# EAGLE board ETEST01 (EAGLE 7.3.0), part 1 of 2
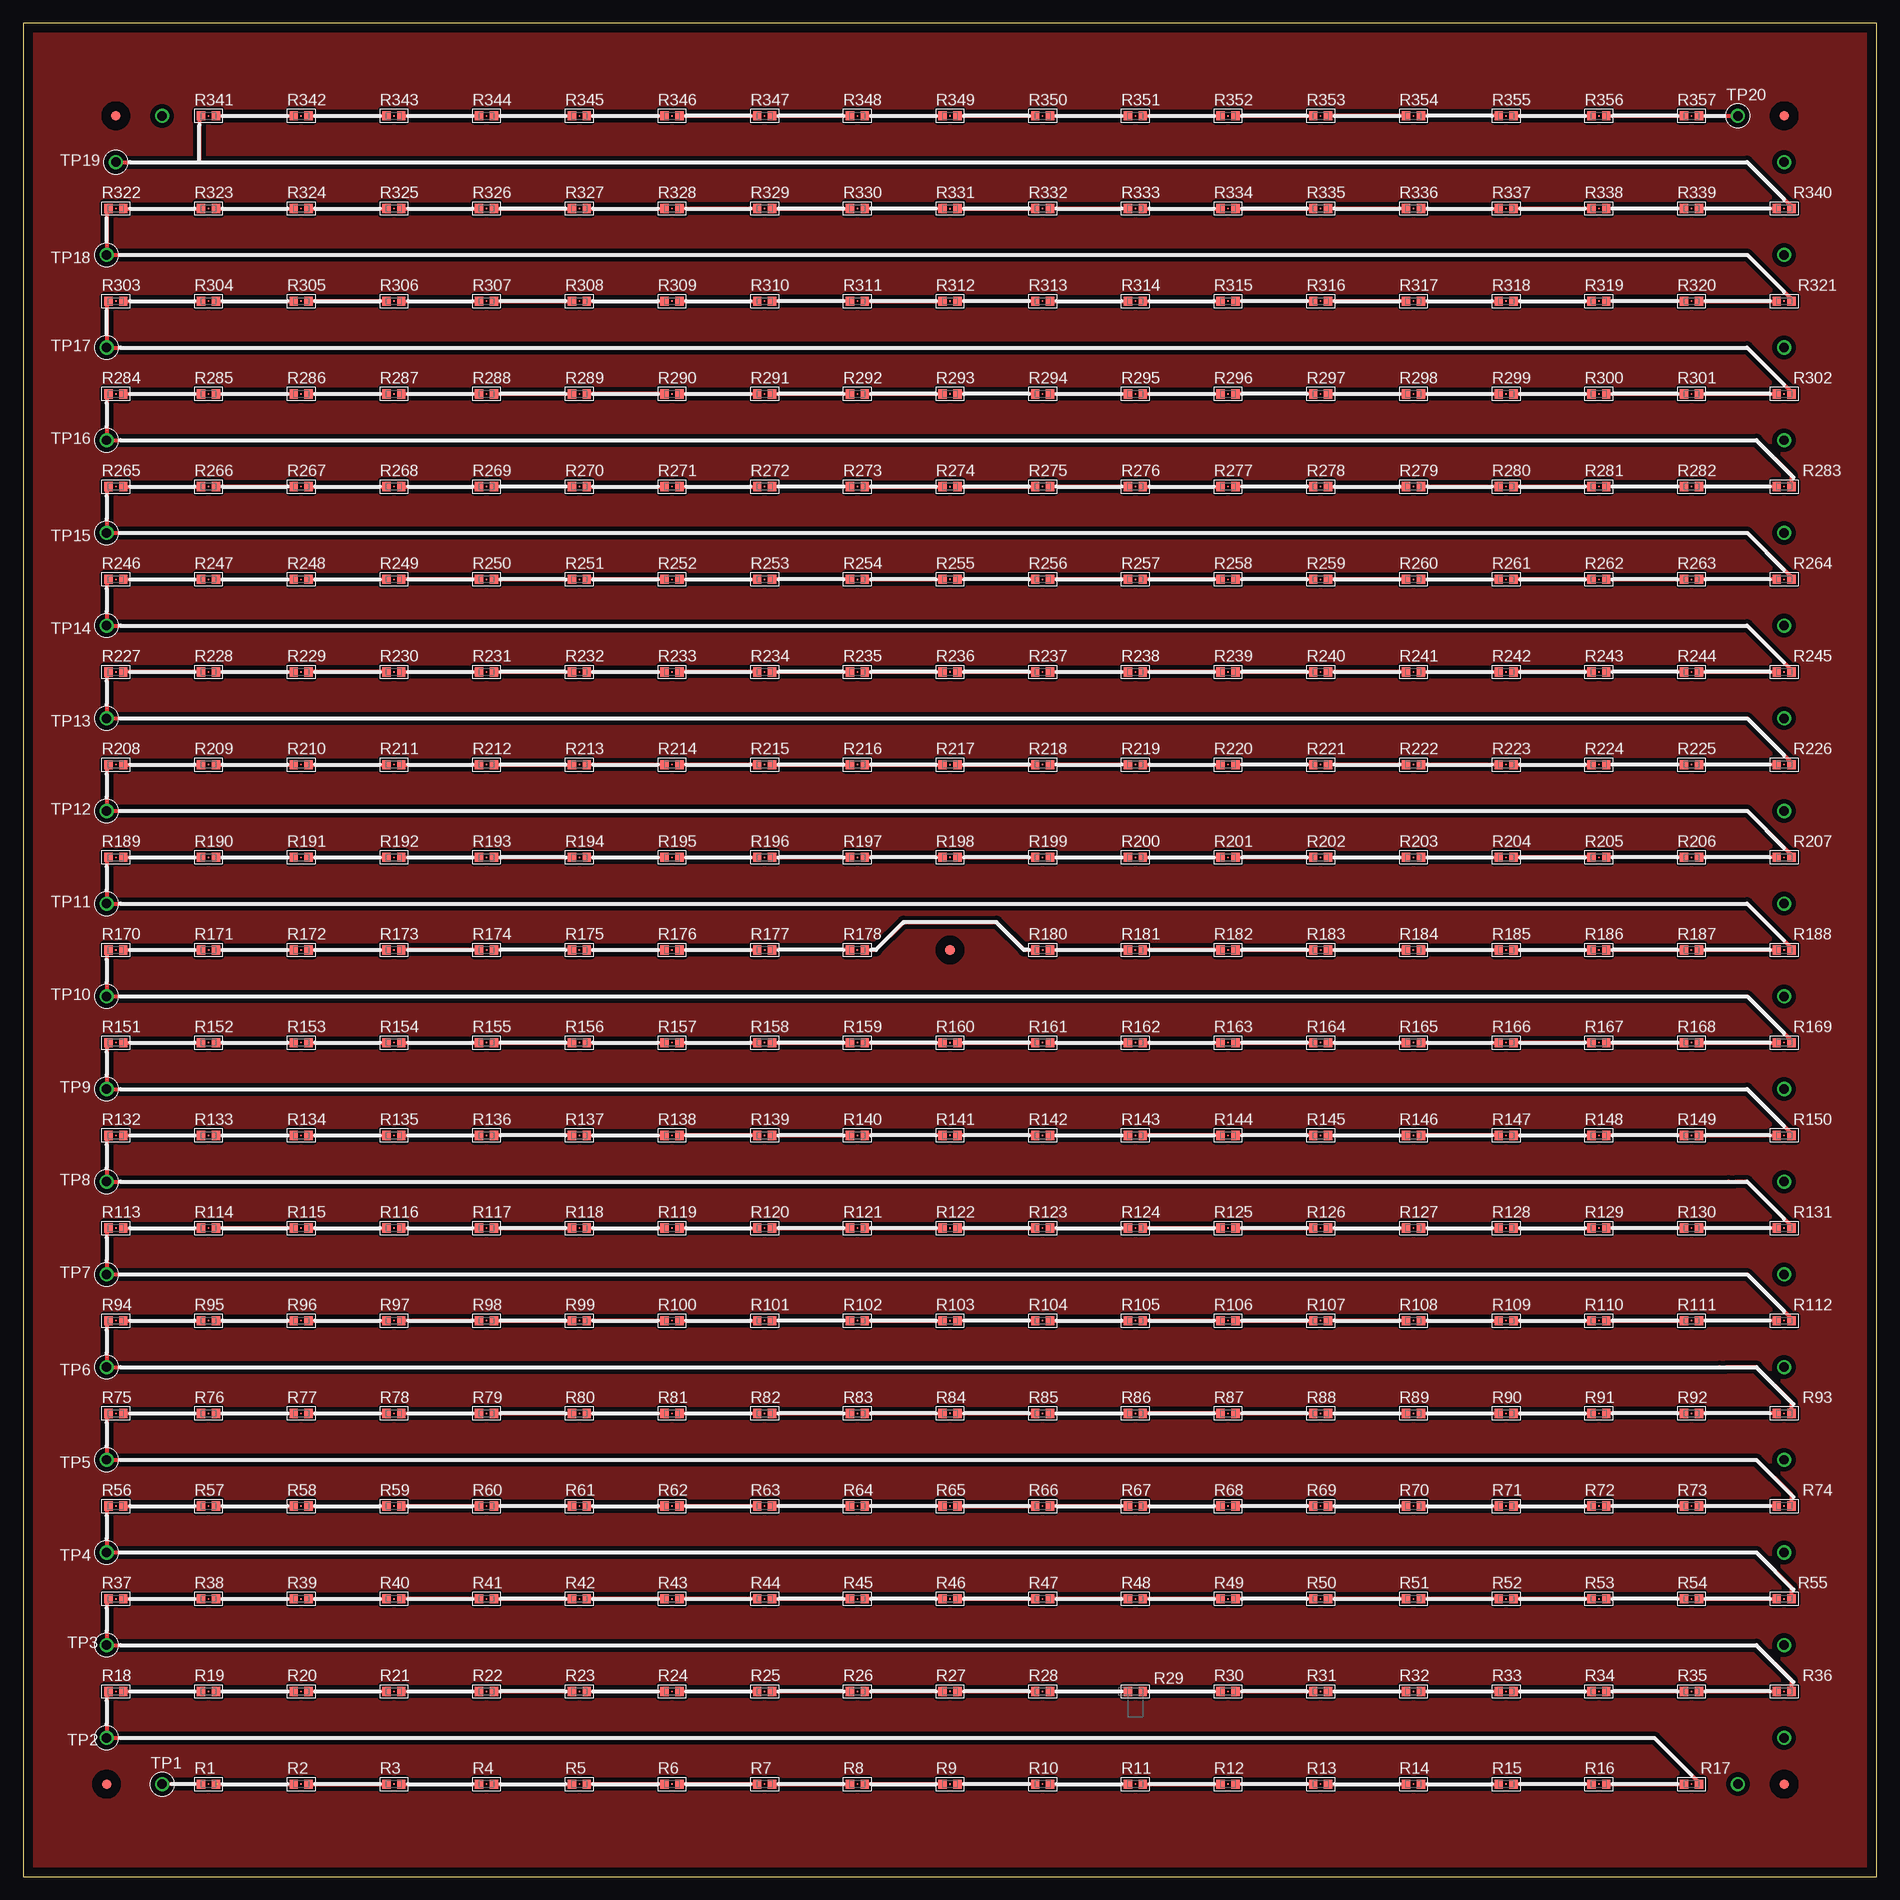
[diagram p2: board, top side]
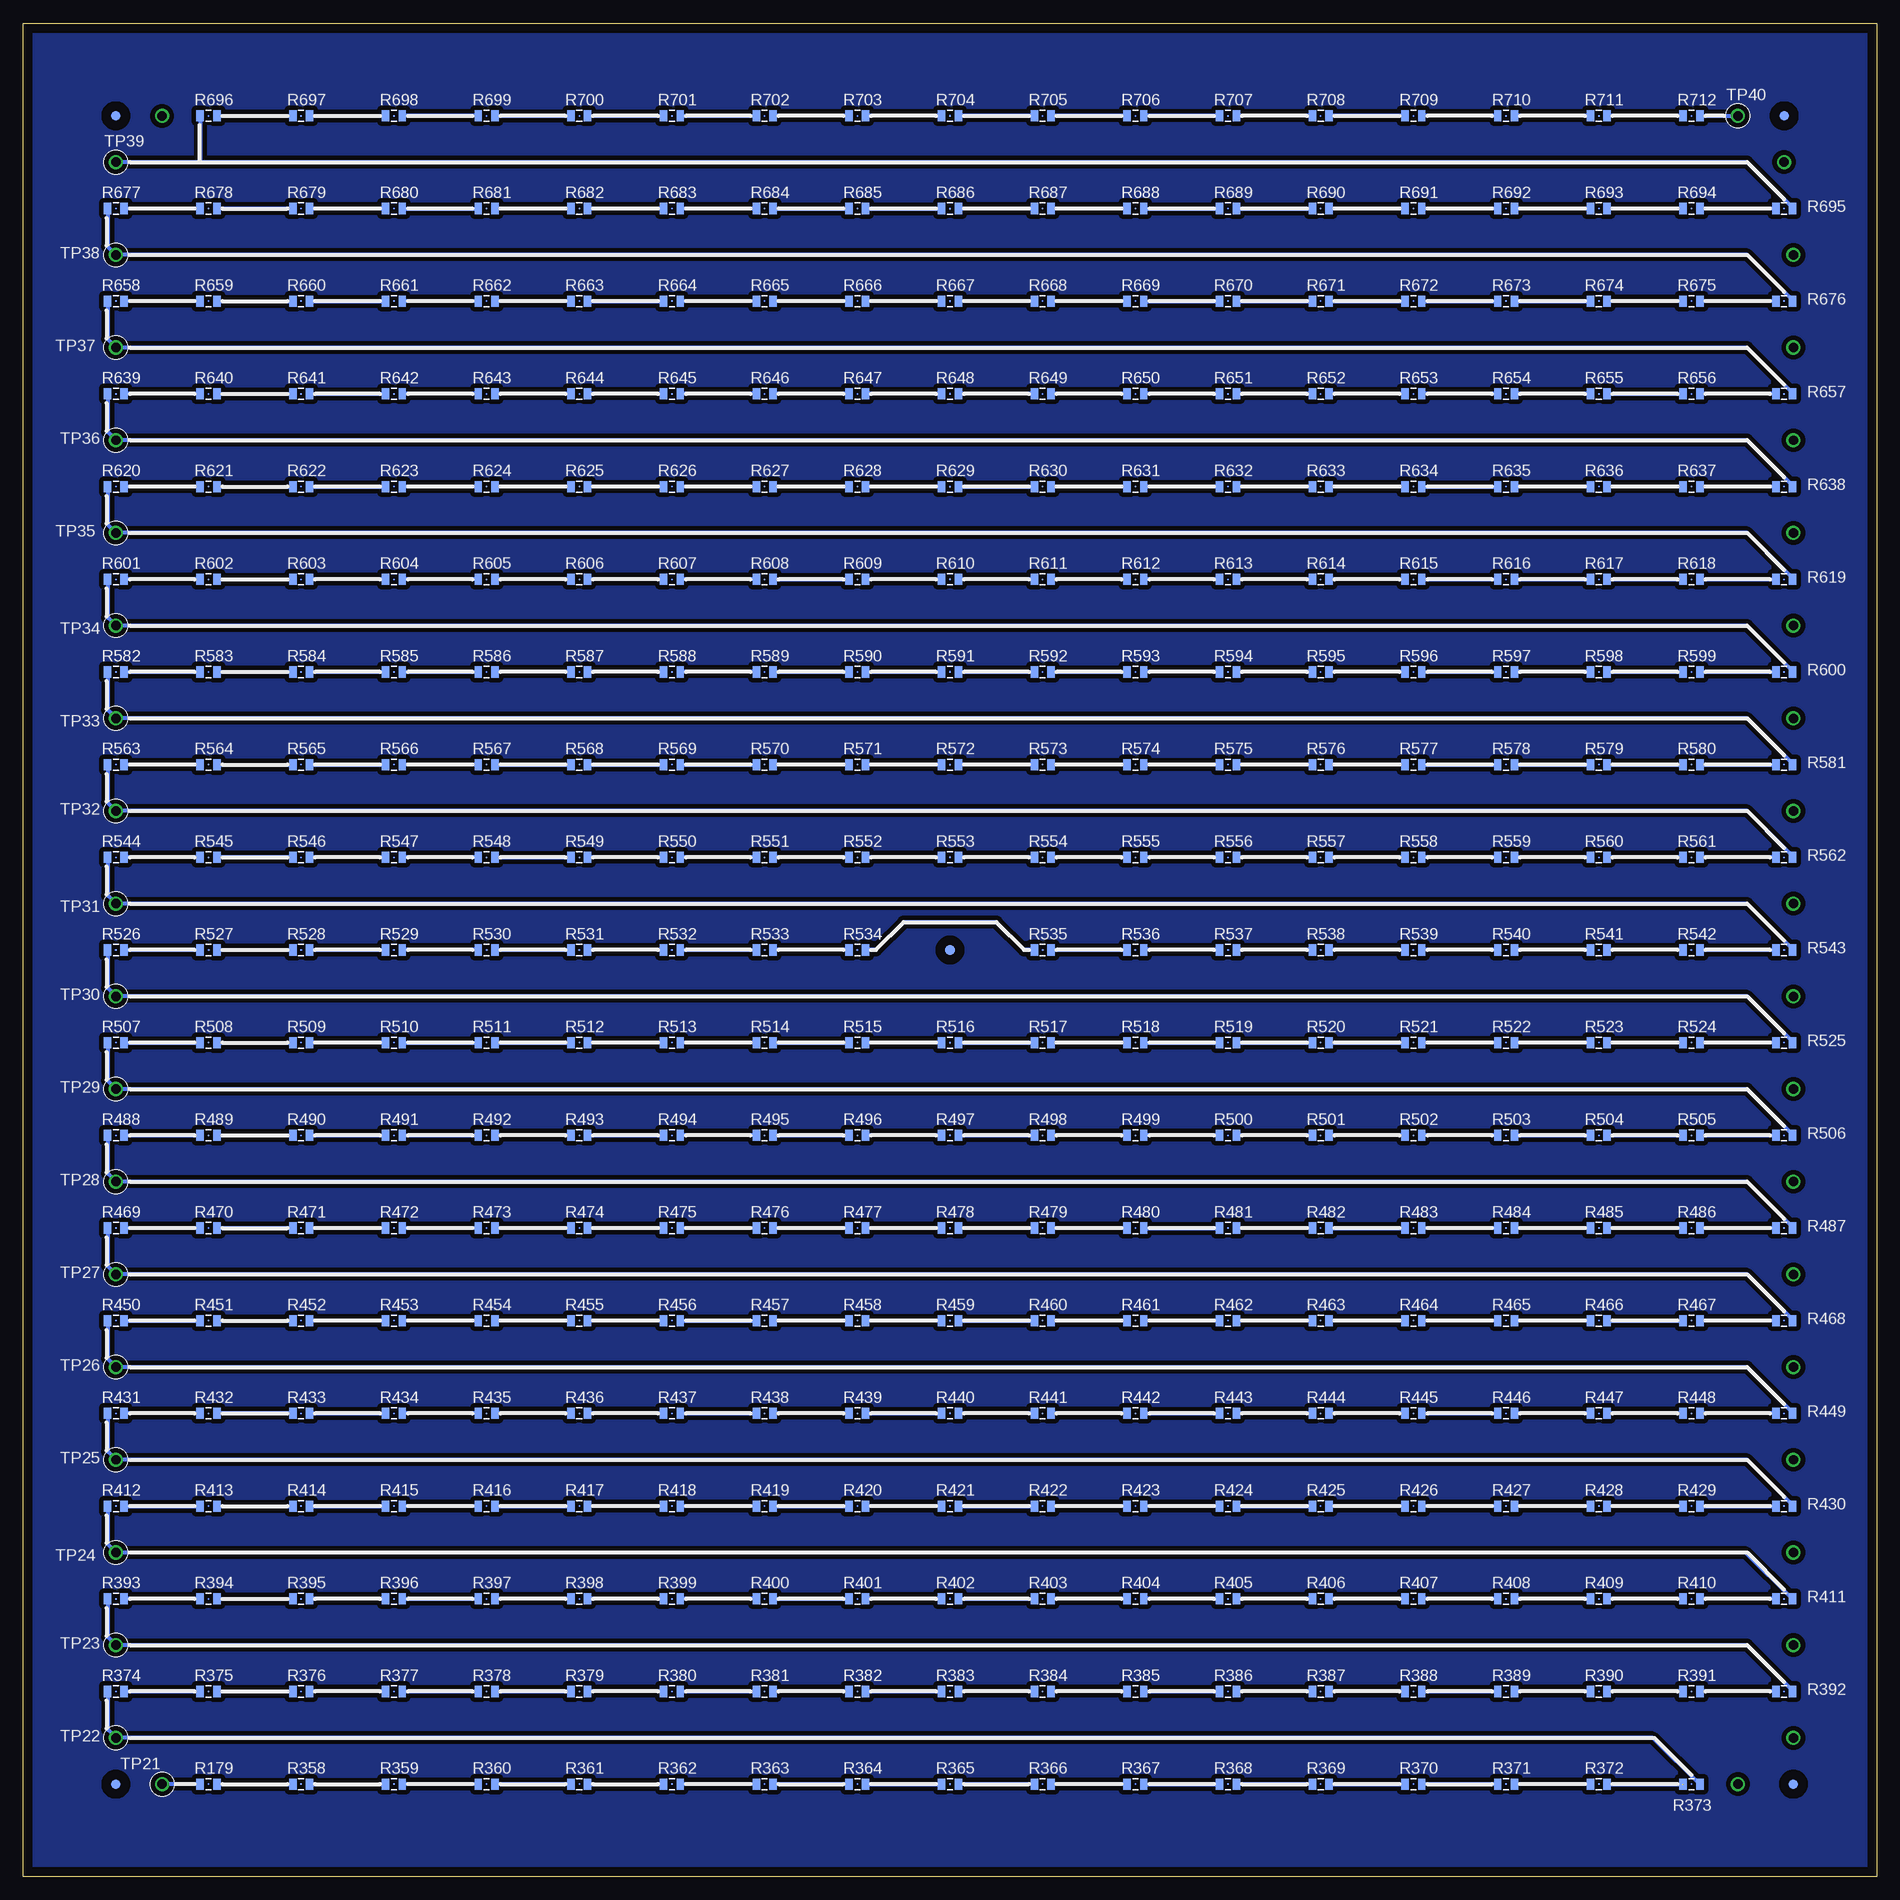
[diagram p3: board, bottom side, seen from below]

Size 200 x 200 mm. Coordinates in mm from the lower left corner, seen from the top.
Outline: 0,0 200,0 200,200 0,200 0,0
Copper layers (1*16): Top 0.035mm / dielectric 1.5mm / Bottom 0.035mm
Design rules "default": minimum track width 10mil, minimum drill 24mil, track to track 8mil, track to pad 8mil, pad to pad 8mil, via to via 8mil, smd to smd 8mil, copper to edge 40mil, drill to drill 8mil, minimum pad ring 10mil, minimum via ring 8mil, stop-mask expansion 4mil, vias tented up to drill 0mil, thermal gap 10mil

## Footprints (pad centres in the part's own frame; a part is rotated, then mirrored left to right if it is on the bottom)
FIDUCIAL = smd 1 x 1: 1 0,0
TESTPKG-R0603 = smd 0.9 x 1: 1 -0.8,0; 2 0.8,0 | smd 0.2 x 0.2: VISION-DOT 0,0
R0603 = smd 0.9 x 1: 1 -0.8,0; 2 0.8,0
TESTPKG-R0805 = smd 0.8 x 1.2: 1 -0.9,0; 2 0.9,0 | smd 0.2 x 0.2: VISION-DOT 0,0
CON-TESTPOINT = drill 1.016: 1 0,0

## Placement (x,y rotation side)
FID1  FIDUCIAL  [FIDUCIAL]  9,10 0 top
FID2  FIDUCIAL  [FIDUCIAL]  190,10 0 top
FID3  FIDUCIAL  [FIDUCIAL]  190,190 0 top
FID4  FIDUCIAL  [FIDUCIAL]  10,190 0 top
FID5  FIDUCIAL  [FIDUCIAL]  100,100 0 top
FID6  FIDUCIAL  [FIDUCIAL]  190,10 0 bottom
FID7  FIDUCIAL  [FIDUCIAL]  9,10 0 bottom
FID8  FIDUCIAL  [FIDUCIAL]  10,190 0 bottom
FID9  FIDUCIAL  [FIDUCIAL]  190,190 0 bottom
FID10  FIDUCIAL  [FIDUCIAL]  100,100 0 bottom
R1  TESTPKG-RESISTOR0603  [TESTPKG-R0603]  20,10 0 top
R2  TESTPKG-RESISTOR0603  [TESTPKG-R0603]  30,10 0 top
R3  TESTPKG-RESISTOR0603  [TESTPKG-R0603]  40,10 0 top
R4  TESTPKG-RESISTOR0603  [TESTPKG-R0603]  50,10 0 top
R5  TESTPKG-RESISTOR0603  [TESTPKG-R0603]  60,10 0 top
R6  TESTPKG-RESISTOR0603  [TESTPKG-R0603]  70,10 0 top
R7  TESTPKG-RESISTOR0603  [TESTPKG-R0603]  80,10 0 top
R8  TESTPKG-RESISTOR0603  [TESTPKG-R0603]  90,10 0 top
R9  TESTPKG-RESISTOR0603  [TESTPKG-R0603]  100,10 0 top
R10  TESTPKG-RESISTOR0603  [TESTPKG-R0603]  110,10 0 top
R11  TESTPKG-RESISTOR0603  [TESTPKG-R0603]  120,10 0 top
R12  TESTPKG-RESISTOR0603  [TESTPKG-R0603]  130,10 0 top
R13  TESTPKG-RESISTOR0603  [TESTPKG-R0603]  140,10 0 top
R14  TESTPKG-RESISTOR0603  [TESTPKG-R0603]  150,10 0 top
R15  TESTPKG-RESISTOR0603  [TESTPKG-R0603]  160,10 0 top
R16  TESTPKG-RESISTOR0603  [TESTPKG-R0603]  170,10 0 top
R17  TESTPKG-RESISTOR0603  [TESTPKG-R0603]  180,10 0 top
R18  TESTPKG-RESISTOR0603  [TESTPKG-R0603]  10,20 0 top
R19  TESTPKG-RESISTOR0603  [TESTPKG-R0603]  20,20 0 top
R20  TESTPKG-RESISTOR0603  [TESTPKG-R0603]  30,20 0 top
R21  TESTPKG-RESISTOR0603  [TESTPKG-R0603]  40,20 0 top
R22  TESTPKG-RESISTOR0603  [TESTPKG-R0603]  50,20 0 top
R23  TESTPKG-RESISTOR0603  [TESTPKG-R0603]  60,20 0 top
R24  TESTPKG-RESISTOR0603  [TESTPKG-R0603]  70,20 0 top
R25  TESTPKG-RESISTOR0603  [TESTPKG-R0603]  80,20 0 top
R26  TESTPKG-RESISTOR0603  [TESTPKG-R0603]  90,20 0 top
R27  TESTPKG-RESISTOR0603  [TESTPKG-R0603]  100,20 0 top
R28  TESTPKG-RESISTOR0603  [TESTPKG-R0603]  110,20 0 top
R29  CPL-RES-0603-0-0.1W  [R0603]  120,20 0 top
R30  TESTPKG-RESISTOR0603  [TESTPKG-R0603]  130,20 0 top
R31  TESTPKG-RESISTOR0603  [TESTPKG-R0603]  140,20 0 top
R32  TESTPKG-RESISTOR0603  [TESTPKG-R0603]  150,20 0 top
R33  TESTPKG-RESISTOR0603  [TESTPKG-R0603]  160,20 0 top
R34  TESTPKG-RESISTOR0603  [TESTPKG-R0603]  170,20 0 top
R35  TESTPKG-RESISTOR0603  [TESTPKG-R0603]  180,20 0 top
R36  TESTPKG-RESISTOR0603  [TESTPKG-R0603]  190,20 0 top
R37  TESTPKG-RESISTOR0603  [TESTPKG-R0603]  10,30 0 top
R38  TESTPKG-RESISTOR0603  [TESTPKG-R0603]  20,30 0 top
R39  TESTPKG-RESISTOR0603  [TESTPKG-R0603]  30,30 0 top
R40  TESTPKG-RESISTOR0603  [TESTPKG-R0603]  40,30 0 top
R41  TESTPKG-RESISTOR0603  [TESTPKG-R0603]  50,30 0 top
R42  TESTPKG-RESISTOR0603  [TESTPKG-R0603]  60,30 0 top
R43  TESTPKG-RESISTOR0603  [TESTPKG-R0603]  70,30 0 top
R44  TESTPKG-RESISTOR0603  [TESTPKG-R0603]  80,30 0 top
R45  TESTPKG-RESISTOR0603  [TESTPKG-R0603]  90,30 0 top
R46  TESTPKG-RESISTOR0603  [TESTPKG-R0603]  100,30 0 top
R47  TESTPKG-RESISTOR0603  [TESTPKG-R0603]  110,30 0 top
R48  TESTPKG-RESISTOR0603  [TESTPKG-R0603]  120,30 0 top
R49  TESTPKG-RESISTOR0603  [TESTPKG-R0603]  130,30 0 top
R50  TESTPKG-RESISTOR0603  [TESTPKG-R0603]  140,30 0 top
R51  TESTPKG-RESISTOR0603  [TESTPKG-R0603]  150,30 0 top
R52  TESTPKG-RESISTOR0603  [TESTPKG-R0603]  160,30 0 top
R53  TESTPKG-RESISTOR0603  [TESTPKG-R0603]  170,30 0 top
R54  TESTPKG-RESISTOR0603  [TESTPKG-R0603]  180,30 0 top
R55  TESTPKG-RESISTOR0603  [TESTPKG-R0603]  190,30 0 top
R56  TESTPKG-RESISTOR0603  [TESTPKG-R0603]  10,40 0 top
R57  TESTPKG-RESISTOR0603  [TESTPKG-R0603]  20,40 0 top
R58  TESTPKG-RESISTOR0603  [TESTPKG-R0603]  30,40 0 top
R59  TESTPKG-RESISTOR0603  [TESTPKG-R0603]  40,40 0 top
R60  TESTPKG-RESISTOR0603  [TESTPKG-R0603]  50,40 0 top
R61  TESTPKG-RESISTOR0603  [TESTPKG-R0603]  60,40 0 top
R62  TESTPKG-RESISTOR0603  [TESTPKG-R0603]  70,40 0 top
R63  TESTPKG-RESISTOR0603  [TESTPKG-R0603]  80,40 0 top
R64  TESTPKG-RESISTOR0603  [TESTPKG-R0603]  90,40 0 top
R65  TESTPKG-RESISTOR0603  [TESTPKG-R0603]  100,40 0 top
R66  TESTPKG-RESISTOR0603  [TESTPKG-R0603]  110,40 0 top
R67  TESTPKG-RESISTOR0603  [TESTPKG-R0603]  120,40 0 top
R68  TESTPKG-RESISTOR0603  [TESTPKG-R0603]  130,40 0 top
R69  TESTPKG-RESISTOR0603  [TESTPKG-R0603]  140,40 0 top
R70  TESTPKG-RESISTOR0603  [TESTPKG-R0603]  150,40 0 top
R71  TESTPKG-RESISTOR0603  [TESTPKG-R0603]  160,40 0 top
R72  TESTPKG-RESISTOR0603  [TESTPKG-R0603]  170,40 0 top
R73  TESTPKG-RESISTOR0603  [TESTPKG-R0603]  180,40 0 top
R74  TESTPKG-RESISTOR0603  [TESTPKG-R0603]  190,40 0 top
R75  TESTPKG-RESISTOR0603  [TESTPKG-R0603]  10,50 0 top
R76  TESTPKG-RESISTOR0603  [TESTPKG-R0603]  20,50 0 top
R77  TESTPKG-RESISTOR0603  [TESTPKG-R0603]  30,50 0 top
R78  TESTPKG-RESISTOR0603  [TESTPKG-R0603]  40,50 0 top
R79  TESTPKG-RESISTOR0603  [TESTPKG-R0603]  50,50 0 top
R80  TESTPKG-RESISTOR0603  [TESTPKG-R0603]  60,50 0 top
R81  TESTPKG-RESISTOR0603  [TESTPKG-R0603]  70,50 0 top
R82  TESTPKG-RESISTOR0603  [TESTPKG-R0603]  80,50 0 top
R83  TESTPKG-RESISTOR0603  [TESTPKG-R0603]  90,50 0 top
R84  TESTPKG-RESISTOR0603  [TESTPKG-R0603]  100,50 0 top
R85  TESTPKG-RESISTOR0603  [TESTPKG-R0603]  110,50 0 top
R86  TESTPKG-RESISTOR0603  [TESTPKG-R0603]  120,50 0 top
R87  TESTPKG-RESISTOR0603  [TESTPKG-R0603]  130,50 0 top
R88  TESTPKG-RESISTOR0603  [TESTPKG-R0603]  140,50 0 top
R89  TESTPKG-RESISTOR0603  [TESTPKG-R0603]  150,50 0 top
R90  TESTPKG-RESISTOR0603  [TESTPKG-R0603]  160,50 0 top
R91  TESTPKG-RESISTOR0603  [TESTPKG-R0603]  170,50 0 top
R92  TESTPKG-RESISTOR0603  [TESTPKG-R0603]  180,50 0 top
R93  TESTPKG-RESISTOR0603  [TESTPKG-R0603]  190,50 0 top
R94  TESTPKG-RESISTOR0603  [TESTPKG-R0603]  10,60 0 top
R95  TESTPKG-RESISTOR0603  [TESTPKG-R0603]  20,60 0 top
R96  TESTPKG-RESISTOR0603  [TESTPKG-R0603]  30,60 0 top
R97  TESTPKG-RESISTOR0603  [TESTPKG-R0603]  40,60 0 top
R98  TESTPKG-RESISTOR0603  [TESTPKG-R0603]  50,60 0 top
R99  TESTPKG-RESISTOR0603  [TESTPKG-R0603]  60,60 0 top
R100  TESTPKG-RESISTOR0603  [TESTPKG-R0603]  70,60 0 top
R101  TESTPKG-RESISTOR0603  [TESTPKG-R0603]  80,60 0 top
R102  TESTPKG-RESISTOR0603  [TESTPKG-R0603]  90,60 0 top
R103  TESTPKG-RESISTOR0603  [TESTPKG-R0603]  100,60 0 top
R104  TESTPKG-RESISTOR0603  [TESTPKG-R0603]  110,60 0 top
R105  TESTPKG-RESISTOR0603  [TESTPKG-R0603]  120,60 0 top
R106  TESTPKG-RESISTOR0603  [TESTPKG-R0603]  130,60 0 top
R107  TESTPKG-RESISTOR0603  [TESTPKG-R0603]  140,60 0 top
R108  TESTPKG-RESISTOR0603  [TESTPKG-R0603]  150,60 0 top
R109  TESTPKG-RESISTOR0603  [TESTPKG-R0603]  160,60 0 top
R110  TESTPKG-RESISTOR0603  [TESTPKG-R0603]  170,60 0 top
R111  TESTPKG-RESISTOR0603  [TESTPKG-R0603]  180,60 0 top
R112  TESTPKG-RESISTOR0603  [TESTPKG-R0603]  190,60 0 top
R113  TESTPKG-RESISTOR0603  [TESTPKG-R0603]  10,70 0 top
R114  TESTPKG-RESISTOR0603  [TESTPKG-R0603]  20,70 0 top
R115  TESTPKG-RESISTOR0603  [TESTPKG-R0603]  30,70 0 top
R116  TESTPKG-RESISTOR0603  [TESTPKG-R0603]  40,70 0 top
R117  TESTPKG-RESISTOR0603  [TESTPKG-R0603]  50,70 0 top
R118  TESTPKG-RESISTOR0603  [TESTPKG-R0603]  60,70 0 top
R119  TESTPKG-RESISTOR0603  [TESTPKG-R0603]  70,70 0 top
R120  TESTPKG-RESISTOR0603  [TESTPKG-R0603]  80,70 0 top
R121  TESTPKG-RESISTOR0603  [TESTPKG-R0603]  90,70 0 top
R122  TESTPKG-RESISTOR0603  [TESTPKG-R0603]  100,70 0 top
R123  TESTPKG-RESISTOR0603  [TESTPKG-R0603]  110,70 0 top
R124  TESTPKG-RESISTOR0603  [TESTPKG-R0603]  120,70 0 top
R125  TESTPKG-RESISTOR0603  [TESTPKG-R0603]  130,70 0 top
R126  TESTPKG-RESISTOR0603  [TESTPKG-R0603]  140,70 0 top
R127  TESTPKG-RESISTOR0603  [TESTPKG-R0603]  150,70 0 top
R128  TESTPKG-RESISTOR0603  [TESTPKG-R0603]  160,70 0 top
R129  TESTPKG-RESISTOR0603  [TESTPKG-R0603]  170,70 0 top
R130  TESTPKG-RESISTOR0603  [TESTPKG-R0603]  180,70 0 top
R131  TESTPKG-RESISTOR0603  [TESTPKG-R0603]  190,70 0 top
R132  TESTPKG-RESISTOR0603  [TESTPKG-R0603]  10,80 0 top
R133  TESTPKG-RESISTOR0603  [TESTPKG-R0603]  20,80 0 top
R134  TESTPKG-RESISTOR0603  [TESTPKG-R0603]  30,80 0 top
R135  TESTPKG-RESISTOR0603  [TESTPKG-R0603]  40,80 0 top
R136  TESTPKG-RESISTOR0603  [TESTPKG-R0603]  50,80 0 top
R137  TESTPKG-RESISTOR0603  [TESTPKG-R0603]  60,80 0 top
R138  TESTPKG-RESISTOR0603  [TESTPKG-R0603]  70,80 0 top
R139  TESTPKG-RESISTOR0603  [TESTPKG-R0603]  80,80 0 top
R140  TESTPKG-RESISTOR0603  [TESTPKG-R0603]  90,80 0 top
R141  TESTPKG-RESISTOR0603  [TESTPKG-R0603]  100,80 0 top
R142  TESTPKG-RESISTOR0603  [TESTPKG-R0603]  110,80 0 top
R143  TESTPKG-RESISTOR0603  [TESTPKG-R0603]  120,80 0 top
R144  TESTPKG-RESISTOR0603  [TESTPKG-R0603]  130,80 0 top
R145  TESTPKG-RESISTOR0603  [TESTPKG-R0603]  140,80 0 top
R146  TESTPKG-RESISTOR0603  [TESTPKG-R0603]  150,80 0 top
R147  TESTPKG-RESISTOR0603  [TESTPKG-R0603]  160,80 0 top
R148  TESTPKG-RESISTOR0603  [TESTPKG-R0603]  170,80 0 top
R149  TESTPKG-RESISTOR0603  [TESTPKG-R0603]  180,80 0 top
R150  TESTPKG-RESISTOR0603  [TESTPKG-R0603]  190,80 0 top
R151  TESTPKG-RESISTOR0603  [TESTPKG-R0603]  10,90 0 top
R152  TESTPKG-RESISTOR0603  [TESTPKG-R0603]  20,90 0 top
R153  TESTPKG-RESISTOR0603  [TESTPKG-R0603]  30,90 0 top
R154  TESTPKG-RESISTOR0603  [TESTPKG-R0603]  40,90 0 top
R155  TESTPKG-RESISTOR0603  [TESTPKG-R0603]  50,90 0 top
R156  TESTPKG-RESISTOR0603  [TESTPKG-R0603]  60,90 0 top
R157  TESTPKG-RESISTOR0603  [TESTPKG-R0603]  70,90 0 top
R158  TESTPKG-RESISTOR0603  [TESTPKG-R0603]  80,90 0 top
R159  TESTPKG-RESISTOR0603  [TESTPKG-R0603]  90,90 0 top
R160  TESTPKG-RESISTOR0603  [TESTPKG-R0603]  100,90 0 top
R161  TESTPKG-RESISTOR0603  [TESTPKG-R0603]  110,90 0 top
R162  TESTPKG-RESISTOR0603  [TESTPKG-R0603]  120,90 0 top
R163  TESTPKG-RESISTOR0603  [TESTPKG-R0603]  130,90 0 top
R164  TESTPKG-RESISTOR0603  [TESTPKG-R0603]  140,90 0 top
R165  TESTPKG-RESISTOR0603  [TESTPKG-R0603]  150,90 0 top
R166  TESTPKG-RESISTOR0603  [TESTPKG-R0603]  160,90 0 top
R167  TESTPKG-RESISTOR0603  [TESTPKG-R0603]  170,90 0 top
R168  TESTPKG-RESISTOR0603  [TESTPKG-R0603]  180,90 0 top
R169  TESTPKG-RESISTOR0603  [TESTPKG-R0603]  190,90 0 top
R170  TESTPKG-RESISTOR0603  [TESTPKG-R0603]  10,100 0 top
R171  TESTPKG-RESISTOR0603  [TESTPKG-R0603]  20,100 0 top
R172  TESTPKG-RESISTOR0603  [TESTPKG-R0603]  30,100 0 top
R173  TESTPKG-RESISTOR0603  [TESTPKG-R0603]  40,100 0 top
R174  TESTPKG-RESISTOR0603  [TESTPKG-R0603]  50,100 0 top
R175  TESTPKG-RESISTOR0603  [TESTPKG-R0603]  60,100 0 top
R176  TESTPKG-RESISTOR0603  [TESTPKG-R0603]  70,100 0 top
R177  TESTPKG-RESISTOR0603  [TESTPKG-R0603]  80,100 0 top
R178  TESTPKG-RESISTOR0603  [TESTPKG-R0603]  90,100 0 top
R179  TESTPKG-RESISTOR0805  [TESTPKG-R0805]  180,10 0 bottom
R180  TESTPKG-RESISTOR0603  [TESTPKG-R0603]  110,100 0 top
R181  TESTPKG-RESISTOR0603  [TESTPKG-R0603]  120,100 0 top
R182  TESTPKG-RESISTOR0603  [TESTPKG-R0603]  130,100 0 top
R183  TESTPKG-RESISTOR0603  [TESTPKG-R0603]  140,100 0 top
R184  TESTPKG-RESISTOR0603  [TESTPKG-R0603]  150,100 0 top
R185  TESTPKG-RESISTOR0603  [TESTPKG-R0603]  160,100 0 top
R186  TESTPKG-RESISTOR0603  [TESTPKG-R0603]  170,100 0 top
R187  TESTPKG-RESISTOR0603  [TESTPKG-R0603]  180,100 0 top
R188  TESTPKG-RESISTOR0603  [TESTPKG-R0603]  190,100 0 top
R189  TESTPKG-RESISTOR0603  [TESTPKG-R0603]  10,110 0 top
R190  TESTPKG-RESISTOR0603  [TESTPKG-R0603]  20,110 0 top
R191  TESTPKG-RESISTOR0603  [TESTPKG-R0603]  30,110 0 top
R192  TESTPKG-RESISTOR0603  [TESTPKG-R0603]  40,110 0 top
R193  TESTPKG-RESISTOR0603  [TESTPKG-R0603]  50,110 0 top
R194  TESTPKG-RESISTOR0603  [TESTPKG-R0603]  60,110 0 top
R195  TESTPKG-RESISTOR0603  [TESTPKG-R0603]  70,110 0 top
R196  TESTPKG-RESISTOR0603  [TESTPKG-R0603]  80,110 0 top
R197  TESTPKG-RESISTOR0603  [TESTPKG-R0603]  90,110 0 top
R198  TESTPKG-RESISTOR0603  [TESTPKG-R0603]  100,110 0 top
R199  TESTPKG-RESISTOR0603  [TESTPKG-R0603]  110,110 0 top
R200  TESTPKG-RESISTOR0603  [TESTPKG-R0603]  120,110 0 top
R201  TESTPKG-RESISTOR0603  [TESTPKG-R0603]  130,110 0 top
R202  TESTPKG-RESISTOR0603  [TESTPKG-R0603]  140,110 0 top
R203  TESTPKG-RESISTOR0603  [TESTPKG-R0603]  150,110 0 top
R204  TESTPKG-RESISTOR0603  [TESTPKG-R0603]  160,110 0 top
R205  TESTPKG-RESISTOR0603  [TESTPKG-R0603]  170,110 0 top
R206  TESTPKG-RESISTOR0603  [TESTPKG-R0603]  180,110 0 top
R207  TESTPKG-RESISTOR0603  [TESTPKG-R0603]  190,110 0 top
R208  TESTPKG-RESISTOR0603  [TESTPKG-R0603]  10,120 0 top
R209  TESTPKG-RESISTOR0603  [TESTPKG-R0603]  20,120 0 top
R210  TESTPKG-RESISTOR0603  [TESTPKG-R0603]  30,120 0 top
R211  TESTPKG-RESISTOR0603  [TESTPKG-R0603]  40,120 0 top
R212  TESTPKG-RESISTOR0603  [TESTPKG-R0603]  50,120 0 top
R213  TESTPKG-RESISTOR0603  [TESTPKG-R0603]  60,120 0 top
R214  TESTPKG-RESISTOR0603  [TESTPKG-R0603]  70,120 0 top
R215  TESTPKG-RESISTOR0603  [TESTPKG-R0603]  80,120 0 top
R216  TESTPKG-RESISTOR0603  [TESTPKG-R0603]  90,120 0 top
R217  TESTPKG-RESISTOR0603  [TESTPKG-R0603]  100,120 0 top
R218  TESTPKG-RESISTOR0603  [TESTPKG-R0603]  110,120 0 top
R219  TESTPKG-RESISTOR0603  [TESTPKG-R0603]  120,120 0 top
R220  TESTPKG-RESISTOR0603  [TESTPKG-R0603]  130,120 0 top
R221  TESTPKG-RESISTOR0603  [TESTPKG-R0603]  140,120 0 top
R222  TESTPKG-RESISTOR0603  [TESTPKG-R0603]  150,120 0 top
R223  TESTPKG-RESISTOR0603  [TESTPKG-R0603]  160,120 0 top
R224  TESTPKG-RESISTOR0603  [TESTPKG-R0603]  170,120 0 top
R225  TESTPKG-RESISTOR0603  [TESTPKG-R0603]  180,120 0 top
R226  TESTPKG-RESISTOR0603  [TESTPKG-R0603]  190,120 0 top
R227  TESTPKG-RESISTOR0603  [TESTPKG-R0603]  10,130 0 top
R228  TESTPKG-RESISTOR0603  [TESTPKG-R0603]  20,130 0 top
R229  TESTPKG-RESISTOR0603  [TESTPKG-R0603]  30,130 0 top
R230  TESTPKG-RESISTOR0603  [TESTPKG-R0603]  40,130 0 top
R231  TESTPKG-RESISTOR0603  [TESTPKG-R0603]  50,130 0 top
R232  TESTPKG-RESISTOR0603  [TESTPKG-R0603]  60,130 0 top
R233  TESTPKG-RESISTOR0603  [TESTPKG-R0603]  70,130 0 top
R234  TESTPKG-RESISTOR0603  [TESTPKG-R0603]  80,130 0 top
R235  TESTPKG-RESISTOR0603  [TESTPKG-R0603]  90,130 0 top
R236  TESTPKG-RESISTOR0603  [TESTPKG-R0603]  100,130 0 top
R237  TESTPKG-RESISTOR0603  [TESTPKG-R0603]  110,130 0 top
R238  TESTPKG-RESISTOR0603  [TESTPKG-R0603]  120,130 0 top
R239  TESTPKG-RESISTOR0603  [TESTPKG-R0603]  130,130 0 top
R240  TESTPKG-RESISTOR0603  [TESTPKG-R0603]  140,130 0 top
R241  TESTPKG-RESISTOR0603  [TESTPKG-R0603]  150,130 0 top
R242  TESTPKG-RESISTOR0603  [TESTPKG-R0603]  160,130 0 top
R243  TESTPKG-RESISTOR0603  [TESTPKG-R0603]  170,130 0 top
R244  TESTPKG-RESISTOR0603  [TESTPKG-R0603]  180,130 0 top
R245  TESTPKG-RESISTOR0603  [TESTPKG-R0603]  190,130 0 top
R246  TESTPKG-RESISTOR0603  [TESTPKG-R0603]  10,140 0 top
R247  TESTPKG-RESISTOR0603  [TESTPKG-R0603]  20,140 0 top
R248  TESTPKG-RESISTOR0603  [TESTPKG-R0603]  30,140 0 top
R249  TESTPKG-RESISTOR0603  [TESTPKG-R0603]  40,140 0 top
R250  TESTPKG-RESISTOR0603  [TESTPKG-R0603]  50,140 0 top
R251  TESTPKG-RESISTOR0603  [TESTPKG-R0603]  60,140 0 top
R252  TESTPKG-RESISTOR0603  [TESTPKG-R0603]  70,140 0 top
R253  TESTPKG-RESISTOR0603  [TESTPKG-R0603]  80,140 0 top
R254  TESTPKG-RESISTOR0603  [TESTPKG-R0603]  90,140 0 top
R255  TESTPKG-RESISTOR0603  [TESTPKG-R0603]  100,140 0 top
R256  TESTPKG-RESISTOR0603  [TESTPKG-R0603]  110,140 0 top
R257  TESTPKG-RESISTOR0603  [TESTPKG-R0603]  120,140 0 top
R258  TESTPKG-RESISTOR0603  [TESTPKG-R0603]  130,140 0 top
R259  TESTPKG-RESISTOR0603  [TESTPKG-R0603]  140,140 0 top
R260  TESTPKG-RESISTOR0603  [TESTPKG-R0603]  150,140 0 top
R261  TESTPKG-RESISTOR0603  [TESTPKG-R0603]  160,140 0 top
R262  TESTPKG-RESISTOR0603  [TESTPKG-R0603]  170,140 0 top
R263  TESTPKG-RESISTOR0603  [TESTPKG-R0603]  180,140 0 top
R264  TESTPKG-RESISTOR0603  [TESTPKG-R0603]  190,140 0 top
R265  TESTPKG-RESISTOR0603  [TESTPKG-R0603]  10,150 0 top
R266  TESTPKG-RESISTOR0603  [TESTPKG-R0603]  20,150 0 top
R267  TESTPKG-RESISTOR0603  [TESTPKG-R0603]  30,150 0 top
R268  TESTPKG-RESISTOR0603  [TESTPKG-R0603]  40,150 0 top
R269  TESTPKG-RESISTOR0603  [TESTPKG-R0603]  50,150 0 top
R270  TESTPKG-RESISTOR0603  [TESTPKG-R0603]  60,150 0 top
R271  TESTPKG-RESISTOR0603  [TESTPKG-R0603]  70,150 0 top
R272  TESTPKG-RESISTOR0603  [TESTPKG-R0603]  80,150 0 top
R273  TESTPKG-RESISTOR0603  [TESTPKG-R0603]  90,150 0 top
R274  TESTPKG-RESISTOR0603  [TESTPKG-R0603]  100,150 0 top
R275  TESTPKG-RESISTOR0603  [TESTPKG-R0603]  110,150 0 top
R276  TESTPKG-RESISTOR0603  [TESTPKG-R0603]  120,150 0 top
R277  TESTPKG-RESISTOR0603  [TESTPKG-R0603]  130,150 0 top
R278  TESTPKG-RESISTOR0603  [TESTPKG-R0603]  140,150 0 top
R279  TESTPKG-RESISTOR0603  [TESTPKG-R0603]  150,150 0 top
R280  TESTPKG-RESISTOR0603  [TESTPKG-R0603]  160,150 0 top
R281  TESTPKG-RESISTOR0603  [TESTPKG-R0603]  170,150 0 top
R282  TESTPKG-RESISTOR0603  [TESTPKG-R0603]  180,150 0 top
R283  TESTPKG-RESISTOR0603  [TESTPKG-R0603]  190,150 0 top
R284  TESTPKG-RESISTOR0603  [TESTPKG-R0603]  10,160 0 top
R285  TESTPKG-RESISTOR0603  [TESTPKG-R0603]  20,160 0 top
R286  TESTPKG-RESISTOR0603  [TESTPKG-R0603]  30,160 0 top
R287  TESTPKG-RESISTOR0603  [TESTPKG-R0603]  40,160 0 top
R288  TESTPKG-RESISTOR0603  [TESTPKG-R0603]  50,160 0 top
R289  TESTPKG-RESISTOR0603  [TESTPKG-R0603]  60,160 0 top
R290  TESTPKG-RESISTOR0603  [TESTPKG-R0603]  70,160 0 top
R291  TESTPKG-RESISTOR0603  [TESTPKG-R0603]  80,160 0 top
R292  TESTPKG-RESISTOR0603  [TESTPKG-R0603]  90,160 0 top
R293  TESTPKG-RESISTOR0603  [TESTPKG-R0603]  100,160 0 top
R294  TESTPKG-RESISTOR0603  [TESTPKG-R0603]  110,160 0 top
R295  TESTPKG-RESISTOR0603  [TESTPKG-R0603]  120,160 0 top
R296  TESTPKG-RESISTOR0603  [TESTPKG-R0603]  130,160 0 top
R297  TESTPKG-RESISTOR0603  [TESTPKG-R0603]  140,160 0 top
R298  TESTPKG-RESISTOR0603  [TESTPKG-R0603]  150,160 0 top
R299  TESTPKG-RESISTOR0603  [TESTPKG-R0603]  160,160 0 top
R300  TESTPKG-RESISTOR0603  [TESTPKG-R0603]  170,160 0 top
R301  TESTPKG-RESISTOR0603  [TESTPKG-R0603]  180,160 0 top
R302  TESTPKG-RESISTOR0603  [TESTPKG-R0603]  190,160 0 top
R303  TESTPKG-RESISTOR0603  [TESTPKG-R0603]  10,170 0 top
R304  TESTPKG-RESISTOR0603  [TESTPKG-R0603]  20,170 0 top
R305  TESTPKG-RESISTOR0603  [TESTPKG-R0603]  30,170 0 top
R306  TESTPKG-RESISTOR0603  [TESTPKG-R0603]  40,170 0 top
R307  TESTPKG-RESISTOR0603  [TESTPKG-R0603]  50,170 0 top
R308  TESTPKG-RESISTOR0603  [TESTPKG-R0603]  60,170 0 top
R309  TESTPKG-RESISTOR0603  [TESTPKG-R0603]  70,170 0 top
R310  TESTPKG-RESISTOR0603  [TESTPKG-R0603]  80,170 0 top
R311  TESTPKG-RESISTOR0603  [TESTPKG-R0603]  90,170 0 top
R312  TESTPKG-RESISTOR0603  [TESTPKG-R0603]  100,170 0 top
R313  TESTPKG-RESISTOR0603  [TESTPKG-R0603]  110,170 0 top
R314  TESTPKG-RESISTOR0603  [TESTPKG-R0603]  120,170 0 top
R315  TESTPKG-RESISTOR0603  [TESTPKG-R0603]  130,170 0 top
R316  TESTPKG-RESISTOR0603  [TESTPKG-R0603]  140,170 0 top
R317  TESTPKG-RESISTOR0603  [TESTPKG-R0603]  150,170 0 top
R318  TESTPKG-RESISTOR0603  [TESTPKG-R0603]  160,170 0 top
R319  TESTPKG-RESISTOR0603  [TESTPKG-R0603]  170,170 0 top
R320  TESTPKG-RESISTOR0603  [TESTPKG-R0603]  180,170 0 top
R321  TESTPKG-RESISTOR0603  [TESTPKG-R0603]  190,170 0 top
R322  TESTPKG-RESISTOR0603  [TESTPKG-R0603]  10,180 0 top
R323  TESTPKG-RESISTOR0603  [TESTPKG-R0603]  20,180 0 top
R324  TESTPKG-RESISTOR0603  [TESTPKG-R0603]  30,180 0 top
R325  TESTPKG-RESISTOR0603  [TESTPKG-R0603]  40,180 0 top
R326  TESTPKG-RESISTOR0603  [TESTPKG-R0603]  50,180 0 top
R327  TESTPKG-RESISTOR0603  [TESTPKG-R0603]  60,180 0 top
R328  TESTPKG-RESISTOR0603  [TESTPKG-R0603]  70,180 0 top
R329  TESTPKG-RESISTOR0603  [TESTPKG-R0603]  80,180 0 top
R330  TESTPKG-RESISTOR0603  [TESTPKG-R0603]  90,180 0 top
R331  TESTPKG-RESISTOR0603  [TESTPKG-R0603]  100,180 0 top
R332  TESTPKG-RESISTOR0603  [TESTPKG-R0603]  110,180 0 top
R333  TESTPKG-RESISTOR0603  [TESTPKG-R0603]  120,180 0 top
R334  TESTPKG-RESISTOR0603  [TESTPKG-R0603]  130,180 0 top
R335  TESTPKG-RESISTOR0603  [TESTPKG-R0603]  140,180 0 top
R336  TESTPKG-RESISTOR0603  [TESTPKG-R0603]  150,180 0 top
R337  TESTPKG-RESISTOR0603  [TESTPKG-R0603]  160,180 0 top
R338  TESTPKG-RESISTOR0603  [TESTPKG-R0603]  170,180 0 top
R339  TESTPKG-RESISTOR0603  [TESTPKG-R0603]  180,180 0 top
R340  TESTPKG-RESISTOR0603  [TESTPKG-R0603]  190,180 0 top
R341  TESTPKG-RESISTOR0603  [TESTPKG-R0603]  20,190 0 top
R342  TESTPKG-RESISTOR0603  [TESTPKG-R0603]  30,190 0 top
R343  TESTPKG-RESISTOR0603  [TESTPKG-R0603]  40,190 0 top
R344  TESTPKG-RESISTOR0603  [TESTPKG-R0603]  50,190 0 top
R345  TESTPKG-RESISTOR0603  [TESTPKG-R0603]  60,190 0 top
R346  TESTPKG-RESISTOR0603  [TESTPKG-R0603]  70,190 0 top
R347  TESTPKG-RESISTOR0603  [TESTPKG-R0603]  80,190 0 top
R348  TESTPKG-RESISTOR0603  [TESTPKG-R0603]  90,190 0 top
R349  TESTPKG-RESISTOR0603  [TESTPKG-R0603]  100,190 0 top
R350  TESTPKG-RESISTOR0603  [TESTPKG-R0603]  110,190 0 top
R351  TESTPKG-RESISTOR0603  [TESTPKG-R0603]  120,190 0 top
R352  TESTPKG-RESISTOR0603  [TESTPKG-R0603]  130,190 0 top
R353  TESTPKG-RESISTOR0603  [TESTPKG-R0603]  140,190 0 top
R354  TESTPKG-RESISTOR0603  [TESTPKG-R0603]  150,190 0 top
R355  TESTPKG-RESISTOR0603  [TESTPKG-R0603]  160,190 0 top
R356  TESTPKG-RESISTOR0603  [TESTPKG-R0603]  170,190 0 top
R357  TESTPKG-RESISTOR0603  [TESTPKG-R0603]  180,190 0 top
R358  TESTPKG-RESISTOR0805  [TESTPKG-R0805]  170,10 0 bottom
R359  TESTPKG-RESISTOR0805  [TESTPKG-R0805]  160,10 0 bottom
R360  TESTPKG-RESISTOR0805  [TESTPKG-R0805]  150,10 0 bottom
R361  TESTPKG-RESISTOR0805  [TESTPKG-R0805]  140,10 0 bottom
R362  TESTPKG-RESISTOR0805  [TESTPKG-R0805]  130,10 0 bottom
R363  TESTPKG-RESISTOR0805  [TESTPKG-R0805]  120,10 0 bottom
R364  TESTPKG-RESISTOR0805  [TESTPKG-R0805]  110,10 0 bottom
R365  TESTPKG-RESISTOR0805  [TESTPKG-R0805]  100,10 0 bottom
R366  TESTPKG-RESISTOR0805  [TESTPKG-R0805]  90,10 0 bottom
R367  TESTPKG-RESISTOR0805  [TESTPKG-R0805]  80,10 0 bottom
R368  TESTPKG-RESISTOR0805  [TESTPKG-R0805]  70,10 0 bottom
R369  TESTPKG-RESISTOR0805  [TESTPKG-R0805]  60,10 0 bottom
R370  TESTPKG-RESISTOR0805  [TESTPKG-R0805]  50,10 0 bottom
R371  TESTPKG-RESISTOR0805  [TESTPKG-R0805]  40,10 0 bottom
R372  TESTPKG-RESISTOR0805  [TESTPKG-R0805]  30,10 0 bottom
R373  TESTPKG-RESISTOR0805  [TESTPKG-R0805]  20,10 0 bottom
R374  TESTPKG-RESISTOR0805  [TESTPKG-R0805]  190,20 0 bottom
R375  TESTPKG-RESISTOR0805  [TESTPKG-R0805]  180,20 0 bottom
R376  TESTPKG-RESISTOR0805  [TESTPKG-R0805]  170,20 0 bottom
R377  TESTPKG-RESISTOR0805  [TESTPKG-R0805]  160,20 0 bottom
R378  TESTPKG-RESISTOR0805  [TESTPKG-R0805]  150,20 0 bottom
R379  TESTPKG-RESISTOR0805  [TESTPKG-R0805]  140,20 0 bottom
R380  TESTPKG-RESISTOR0805  [TESTPKG-R0805]  130,20 0 bottom
R381  TESTPKG-RESISTOR0805  [TESTPKG-R0805]  120,20 0 bottom
R382  TESTPKG-RESISTOR0805  [TESTPKG-R0805]  110,20 0 bottom
R383  TESTPKG-RESISTOR0805  [TESTPKG-R0805]  100,20 0 bottom
R384  TESTPKG-RESISTOR0805  [TESTPKG-R0805]  90,20 0 bottom
R385  TESTPKG-RESISTOR0805  [TESTPKG-R0805]  80,20 0 bottom
R386  TESTPKG-RESISTOR0805  [TESTPKG-R0805]  70,20 0 bottom
R387  TESTPKG-RESISTOR0805  [TESTPKG-R0805]  60,20 0 bottom
R388  TESTPKG-RESISTOR0805  [TESTPKG-R0805]  50,20 0 bottom
R389  TESTPKG-RESISTOR0805  [TESTPKG-R0805]  40,20 0 bottom
R390  TESTPKG-RESISTOR0805  [TESTPKG-R0805]  30,20 0 bottom
R391  TESTPKG-RESISTOR0805  [TESTPKG-R0805]  20,20 0 bottom
R392  TESTPKG-RESISTOR0805  [TESTPKG-R0805]  10,20 0 bottom
R393  TESTPKG-RESISTOR0805  [TESTPKG-R0805]  190,30 0 bottom
R394  TESTPKG-RESISTOR0805  [TESTPKG-R0805]  180,30 0 bottom
R395  TESTPKG-RESISTOR0805  [TESTPKG-R0805]  170,30 0 bottom
R396  TESTPKG-RESISTOR0805  [TESTPKG-R0805]  160,30 0 bottom
R397  TESTPKG-RESISTOR0805  [TESTPKG-R0805]  150,30 0 bottom
R398  TESTPKG-RESISTOR0805  [TESTPKG-R0805]  140,30 0 bottom
R399  TESTPKG-RESISTOR0805  [TESTPKG-R0805]  130,30 0 bottom
R400  TESTPKG-RESISTOR0805  [TESTPKG-R0805]  120,30 0 bottom
R401  TESTPKG-RESISTOR0805  [TESTPKG-R0805]  110,30 0 bottom
R402  TESTPKG-RESISTOR0805  [TESTPKG-R0805]  100,30 0 bottom
R403  TESTPKG-RESISTOR0805  [TESTPKG-R0805]  90,30 0 bottom
R404  TESTPKG-RESISTOR0805  [TESTPKG-R0805]  80,30 0 bottom
R405  TESTPKG-RESISTOR0805  [TESTPKG-R0805]  70,30 0 bottom
R406  TESTPKG-RESISTOR0805  [TESTPKG-R0805]  60,30 0 bottom
R407  TESTPKG-RESISTOR0805  [TESTPKG-R0805]  50,30 0 bottom
R408  TESTPKG-RESISTOR0805  [TESTPKG-R0805]  40,30 0 bottom
R409  TESTPKG-RESISTOR0805  [TESTPKG-R0805]  30,30 0 bottom
R410  TESTPKG-RESISTOR0805  [TESTPKG-R0805]  20,30 0 bottom
R411  TESTPKG-RESISTOR0805  [TESTPKG-R0805]  10,30 0 bottom
R412  TESTPKG-RESISTOR0805  [TESTPKG-R0805]  190,40 0 bottom
R413  TESTPKG-RESISTOR0805  [TESTPKG-R0805]  180,40 0 bottom
R414  TESTPKG-RESISTOR0805  [TESTPKG-R0805]  170,40 0 bottom
R415  TESTPKG-RESISTOR0805  [TESTPKG-R0805]  160,40 0 bottom
R416  TESTPKG-RESISTOR0805  [TESTPKG-R0805]  150,40 0 bottom
R417  TESTPKG-RESISTOR0805  [TESTPKG-R0805]  140,40 0 bottom
R418  TESTPKG-RESISTOR0805  [TESTPKG-R0805]  130,40 0 bottom
R419  TESTPKG-RESISTOR0805  [TESTPKG-R0805]  120,40 0 bottom
R420  TESTPKG-RESISTOR0805  [TESTPKG-R0805]  110,40 0 bottom
R421  TESTPKG-RESISTOR0805  [TESTPKG-R0805]  100,40 0 bottom
R422  TESTPKG-RESISTOR0805  [TESTPKG-R0805]  90,40 0 bottom
R423  TESTPKG-RESISTOR0805  [TESTPKG-R0805]  80,40 0 bottom
R424  TESTPKG-RESISTOR0805  [TESTPKG-R0805]  70,40 0 bottom
R425  TESTPKG-RESISTOR0805  [TESTPKG-R0805]  60,40 0 bottom
R426  TESTPKG-RESISTOR0805  [TESTPKG-R0805]  50,40 0 bottom
R427  TESTPKG-RESISTOR0805  [TESTPKG-R0805]  40,40 0 bottom
R428  TESTPKG-RESISTOR0805  [TESTPKG-R0805]  30,40 0 bottom
R429  TESTPKG-RESISTOR0805  [TESTPKG-R0805]  20,40 0 bottom
R430  TESTPKG-RESISTOR0805  [TESTPKG-R0805]  10,40 0 bottom
R431  TESTPKG-RESISTOR0805  [TESTPKG-R0805]  190,50 0 bottom
R432  TESTPKG-RESISTOR0805  [TESTPKG-R0805]  180,50 0 bottom
R433  TESTPKG-RESISTOR0805  [TESTPKG-R0805]  170,50 0 bottom
R434  TESTPKG-RESISTOR0805  [TESTPKG-R0805]  160,50 0 bottom
R435  TESTPKG-RESISTOR0805  [TESTPKG-R0805]  150,50 0 bottom
R436  TESTPKG-RESISTOR0805  [TESTPKG-R0805]  140,50 0 bottom
R437  TESTPKG-RESISTOR0805  [TESTPKG-R0805]  130,50 0 bottom
R438  TESTPKG-RESISTOR0805  [TESTPKG-R0805]  120,50 0 bottom
R439  TESTPKG-RESISTOR0805  [TESTPKG-R0805]  110,50 0 bottom
R440  TESTPKG-RESISTOR0805  [TESTPKG-R0805]  100,50 0 bottom
R441  TESTPKG-RESISTOR0805  [TESTPKG-R0805]  90,50 0 bottom
R442  TESTPKG-RESISTOR0805  [TESTPKG-R0805]  80,50 0 bottom
R443  TESTPKG-RESISTOR0805  [TESTPKG-R0805]  70,50 0 bottom
R444  TESTPKG-RESISTOR0805  [TESTPKG-R0805]  60,50 0 bottom
R445  TESTPKG-RESISTOR0805  [TESTPKG-R0805]  50,50 0 bottom
R446  TESTPKG-RESISTOR0805  [TESTPKG-R0805]  40,50 0 bottom
R447  TESTPKG-RESISTOR0805  [TESTPKG-R0805]  30,50 0 bottom
R448  TESTPKG-RESISTOR0805  [TESTPKG-R0805]  20,50 0 bottom
R449  TESTPKG-RESISTOR0805  [TESTPKG-R0805]  10,50 0 bottom
R450  TESTPKG-RESISTOR0805  [TESTPKG-R0805]  190,60 0 bottom
R451  TESTPKG-RESISTOR0805  [TESTPKG-R0805]  180,60 0 bottom
R452  TESTPKG-RESISTOR0805  [TESTPKG-R0805]  170,60 0 bottom
R453  TESTPKG-RESISTOR0805  [TESTPKG-R0805]  160,60 0 bottom
R454  TESTPKG-RESISTOR0805  [TESTPKG-R0805]  150,60 0 bottom
R455  TESTPKG-RESISTOR0805  [TESTPKG-R0805]  140,60 0 bottom
R456  TESTPKG-RESISTOR0805  [TESTPKG-R0805]  130,60 0 bottom
R457  TESTPKG-RESISTOR0805  [TESTPKG-R0805]  120,60 0 bottom
R458  TESTPKG-RESISTOR0805  [TESTPKG-R0805]  110,60 0 bottom
R459  TESTPKG-RESISTOR0805  [TESTPKG-R0805]  100,60 0 bottom
R460  TESTPKG-RESISTOR0805  [TESTPKG-R0805]  90,60 0 bottom
R461  TESTPKG-RESISTOR0805  [TESTPKG-R0805]  80,60 0 bottom
R462  TESTPKG-RESISTOR0805  [TESTPKG-R0805]  70,60 0 bottom
R463  TESTPKG-RESISTOR0805  [TESTPKG-R0805]  60,60 0 bottom
R464  TESTPKG-RESISTOR0805  [TESTPKG-R0805]  50,60 0 bottom
R465  TESTPKG-RESISTOR0805  [TESTPKG-R0805]  40,60 0 bottom
R466  TESTPKG-RESISTOR0805  [TESTPKG-R0805]  30,60 0 bottom
R467  TESTPKG-RESISTOR0805  [TESTPKG-R0805]  20,60 0 bottom
R468  TESTPKG-RESISTOR0805  [TESTPKG-R0805]  10,60 0 bottom
R469  TESTPKG-RESISTOR0805  [TESTPKG-R0805]  190,70 0 bottom
R470  TESTPKG-RESISTOR0805  [TESTPKG-R0805]  180,70 0 bottom
R471  TESTPKG-RESISTOR0805  [TESTPKG-R0805]  170,70 0 bottom
R472  TESTPKG-RESISTOR0805  [TESTPKG-R0805]  160,70 0 bottom
R473  TESTPKG-RESISTOR0805  [TESTPKG-R0805]  150,70 0 bottom
R474  TESTPKG-RESISTOR0805  [TESTPKG-R0805]  140,70 0 bottom
R475  TESTPKG-RESISTOR0805  [TESTPKG-R0805]  130,70 0 bottom
R476  TESTPKG-RESISTOR0805  [TESTPKG-R0805]  120,70 0 bottom
R477  TESTPKG-RESISTOR0805  [TESTPKG-R0805]  110,70 0 bottom
R478  TESTPKG-RESISTOR0805  [TESTPKG-R0805]  100,70 0 bottom
R479  TESTPKG-RESISTOR0805  [TESTPKG-R0805]  90,70 0 bottom
R480  TESTPKG-RESISTOR0805  [TESTPKG-R0805]  80,70 0 bottom
R481  TESTPKG-RESISTOR0805  [TESTPKG-R0805]  70,70 0 bottom
R482  TESTPKG-RESISTOR0805  [TESTPKG-R0805]  60,70 0 bottom
R483  TESTPKG-RESISTOR0805  [TESTPKG-R0805]  50,70 0 bottom
R484  TESTPKG-RESISTOR0805  [TESTPKG-R0805]  40,70 0 bottom
R485  TESTPKG-RESISTOR0805  [TESTPKG-R0805]  30,70 0 bottom
R486  TESTPKG-RESISTOR0805  [TESTPKG-R0805]  20,70 0 bottom
R487  TESTPKG-RESISTOR0805  [TESTPKG-R0805]  10,70 0 bottom
R488  TESTPKG-RESISTOR0805  [TESTPKG-R0805]  190,80 0 bottom
R489  TESTPKG-RESISTOR0805  [TESTPKG-R0805]  180,80 0 bottom
R490  TESTPKG-RESISTOR0805  [TESTPKG-R0805]  170,80 0 bottom
R491  TESTPKG-RESISTOR0805  [TESTPKG-R0805]  160,80 0 bottom
R492  TESTPKG-RESISTOR0805  [TESTPKG-R0805]  150,80 0 bottom
R493  TESTPKG-RESISTOR0805  [TESTPKG-R0805]  140,80 0 bottom
R494  TESTPKG-RESISTOR0805  [TESTPKG-R0805]  130,80 0 bottom
R495  TESTPKG-RESISTOR0805  [TESTPKG-R0805]  120,80 0 bottom
R496  TESTPKG-RESISTOR0805  [TESTPKG-R0805]  110,80 0 bottom
R497  TESTPKG-RESISTOR0805  [TESTPKG-R0805]  100,80 0 bottom
R498  TESTPKG-RESISTOR0805  [TESTPKG-R0805]  90,80 0 bottom
R499  TESTPKG-RESISTOR0805  [TESTPKG-R0805]  80,80 0 bottom
R500  TESTPKG-RESISTOR0805  [TESTPKG-R0805]  70,80 0 bottom
R501  TESTPKG-RESISTOR0805  [TESTPKG-R0805]  60,80 0 bottom
R502  TESTPKG-RESISTOR0805  [TESTPKG-R0805]  50,80 0 bottom
R503  TESTPKG-RESISTOR0805  [TESTPKG-R0805]  40,80 0 bottom
R504  TESTPKG-RESISTOR0805  [TESTPKG-R0805]  30,80 0 bottom
R505  TESTPKG-RESISTOR0805  [TESTPKG-R0805]  20,80 0 bottom
R506  TESTPKG-RESISTOR0805  [TESTPKG-R0805]  10,80 0 bottom
R507  TESTPKG-RESISTOR0805  [TESTPKG-R0805]  190,90 0 bottom
R508  TESTPKG-RESISTOR0805  [TESTPKG-R0805]  180,90 0 bottom
R509  TESTPKG-RESISTOR0805  [TESTPKG-R0805]  170,90 0 bottom
R510  TESTPKG-RESISTOR0805  [TESTPKG-R0805]  160,90 0 bottom
R511  TESTPKG-RESISTOR0805  [TESTPKG-R0805]  150,90 0 bottom
R512  TESTPKG-RESISTOR0805  [TESTPKG-R0805]  140,90 0 bottom
R513  TESTPKG-RESISTOR0805  [TESTPKG-R0805]  130,90 0 bottom
R514  TESTPKG-RESISTOR0805  [TESTPKG-R0805]  120,90 0 bottom
R515  TESTPKG-RESISTOR0805  [TESTPKG-R0805]  110,90 0 bottom
R516  TESTPKG-RESISTOR0805  [TESTPKG-R0805]  100,90 0 bottom
R517  TESTPKG-RESISTOR0805  [TESTPKG-R0805]  90,90 0 bottom
R518  TESTPKG-RESISTOR0805  [TESTPKG-R0805]  80,90 0 bottom
R519  TESTPKG-RESISTOR0805  [TESTPKG-R0805]  70,90 0 bottom
R520  TESTPKG-RESISTOR0805  [TESTPKG-R0805]  60,90 0 bottom
R521  TESTPKG-RESISTOR0805  [TESTPKG-R0805]  50,90 0 bottom
R522  TESTPKG-RESISTOR0805  [TESTPKG-R0805]  40,90 0 bottom
R523  TESTPKG-RESISTOR0805  [TESTPKG-R0805]  30,90 0 bottom
R524  TESTPKG-RESISTOR0805  [TESTPKG-R0805]  20,90 0 bottom
R525  TESTPKG-RESISTOR0805  [TESTPKG-R0805]  10,90 0 bottom
R526  TESTPKG-RESISTOR0805  [TESTPKG-R0805]  190,100 0 bottom
R527  TESTPKG-RESISTOR0805  [TESTPKG-R0805]  180,100 0 bottom
R528  TESTPKG-RESISTOR0805  [TESTPKG-R0805]  170,100 0 bottom
R529  TESTPKG-RESISTOR0805  [TESTPKG-R0805]  160,100 0 bottom
R530  TESTPKG-RESISTOR0805  [TESTPKG-R0805]  150,100 0 bottom
R531  TESTPKG-RESISTOR0805  [TESTPKG-R0805]  140,100 0 bottom
R532  TESTPKG-RESISTOR0805  [TESTPKG-R0805]  130,100 0 bottom
R533  TESTPKG-RESISTOR0805  [TESTPKG-R0805]  120,100 0 bottom
R534  TESTPKG-RESISTOR0805  [TESTPKG-R0805]  110,100 0 bottom
R535  TESTPKG-RESISTOR0805  [TESTPKG-R0805]  90,100 0 bottom
R536  TESTPKG-RESISTOR0805  [TESTPKG-R0805]  80,100 0 bottom
R537  TESTPKG-RESISTOR0805  [TESTPKG-R0805]  70,100 0 bottom
R538  TESTPKG-RESISTOR0805  [TESTPKG-R0805]  60,100 0 bottom
R539  TESTPKG-RESISTOR0805  [TESTPKG-R0805]  50,100 0 bottom
R540  TESTPKG-RESISTOR0805  [TESTPKG-R0805]  40,100 0 bottom
R541  TESTPKG-RESISTOR0805  [TESTPKG-R0805]  30,100 0 bottom
R542  TESTPKG-RESISTOR0805  [TESTPKG-R0805]  20,100 0 bottom
R543  TESTPKG-RESISTOR0805  [TESTPKG-R0805]  10,100 0 bottom
R544  TESTPKG-RESISTOR0805  [TESTPKG-R0805]  190,110 0 bottom
R545  TESTPKG-RESISTOR0805  [TESTPKG-R0805]  180,110 0 bottom
R546  TESTPKG-RESISTOR0805  [TESTPKG-R0805]  170,110 0 bottom
R547  TESTPKG-RESISTOR0805  [TESTPKG-R0805]  160,110 0 bottom
R548  TESTPKG-RESISTOR0805  [TESTPKG-R0805]  150,110 0 bottom
R549  TESTPKG-RESISTOR0805  [TESTPKG-R0805]  140,110 0 bottom
R550  TESTPKG-RESISTOR0805  [TESTPKG-R0805]  130,110 0 bottom
R551  TESTPKG-RESISTOR0805  [TESTPKG-R0805]  120,110 0 bottom
R552  TESTPKG-RESISTOR0805  [TESTPKG-R0805]  110,110 0 bottom
R553  TESTPKG-RESISTOR0805  [TESTPKG-R0805]  100,110 0 bottom
R554  TESTPKG-RESISTOR0805  [TESTPKG-R0805]  90,110 0 bottom
R555  TESTPKG-RESISTOR0805  [TESTPKG-R0805]  80,110 0 bottom
R556  TESTPKG-RESISTOR0805  [TESTPKG-R0805]  70,110 0 bottom
R557  TESTPKG-RESISTOR0805  [TESTPKG-R0805]  60,110 0 bottom
R558  TESTPKG-RESISTOR0805  [TESTPKG-R0805]  50,110 0 bottom
R559  TESTPKG-RESISTOR0805  [TESTPKG-R0805]  40,110 0 bottom
R560  TESTPKG-RESISTOR0805  [TESTPKG-R0805]  30,110 0 bottom
R561  TESTPKG-RESISTOR0805  [TESTPKG-R0805]  20,110 0 bottom
R562  TESTPKG-RESISTOR0805  [TESTPKG-R0805]  10,110 0 bottom
R563  TESTPKG-RESISTOR0805  [TESTPKG-R0805]  190,120 0 bottom
R564  TESTPKG-RESISTOR0805  [TESTPKG-R0805]  180,120 0 bottom
R565  TESTPKG-RESISTOR0805  [TESTPKG-R0805]  170,120 0 bottom
R566  TESTPKG-RESISTOR0805  [TESTPKG-R0805]  160,120 0 bottom
R567  TESTPKG-RESISTOR0805  [TESTPKG-R0805]  150,120 0 bottom
R568  TESTPKG-RESISTOR0805  [TESTPKG-R0805]  140,120 0 bottom
R569  TESTPKG-RESISTOR0805  [TESTPKG-R0805]  130,120 0 bottom
R570  TESTPKG-RESISTOR0805  [TESTPKG-R0805]  120,120 0 bottom
R571  TESTPKG-RESISTOR0805  [TESTPKG-R0805]  110,120 0 bottom
R572  TESTPKG-RESISTOR0805  [TESTPKG-R0805]  100,120 0 bottom
R573  TESTPKG-RESISTOR0805  [TESTPKG-R0805]  90,120 0 bottom
R574  TESTPKG-RESISTOR0805  [TESTPKG-R0805]  80,120 0 bottom
R575  TESTPKG-RESISTOR0805  [TESTPKG-R0805]  70,120 0 bottom
R576  TESTPKG-RESISTOR0805  [TESTPKG-R0805]  60,120 0 bottom
R577  TESTPKG-RESISTOR0805  [TESTPKG-R0805]  50,120 0 bottom
R578  TESTPKG-RESISTOR0805  [TESTPKG-R0805]  40,120 0 bottom
R579  TESTPKG-RESISTOR0805  [TESTPKG-R0805]  30,120 0 bottom
R580  TESTPKG-RESISTOR0805  [TESTPKG-R0805]  20,120 0 bottom
R581  TESTPKG-RESISTOR0805  [TESTPKG-R0805]  10,120 0 bottom
R582  TESTPKG-RESISTOR0805  [TESTPKG-R0805]  190,130 0 bottom
R583  TESTPKG-RESISTOR0805  [TESTPKG-R0805]  180,130 0 bottom
R584  TESTPKG-RESISTOR0805  [TESTPKG-R0805]  170,130 0 bottom
R585  TESTPKG-RESISTOR0805  [TESTPKG-R0805]  160,130 0 bottom
R586  TESTPKG-RESISTOR0805  [TESTPKG-R0805]  150,130 0 bottom
R587  TESTPKG-RESISTOR0805  [TESTPKG-R0805]  140,130 0 bottom
R588  TESTPKG-RESISTOR0805  [TESTPKG-R0805]  130,130 0 bottom
R589  TESTPKG-RESISTOR0805  [TESTPKG-R0805]  120,130 0 bottom
R590  TESTPKG-RESISTOR0805  [TESTPKG-R0805]  110,130 0 bottom
R591  TESTPKG-RESISTOR0805  [TESTPKG-R0805]  100,130 0 bottom
R592  TESTPKG-RESISTOR0805  [TESTPKG-R0805]  90,130 0 bottom
R593  TESTPKG-RESISTOR0805  [TESTPKG-R0805]  80,130 0 bottom
R594  TESTPKG-RESISTOR0805  [TESTPKG-R0805]  70,130 0 bottom
R595  TESTPKG-RESISTOR0805  [TESTPKG-R0805]  60,130 0 bottom
R596  TESTPKG-RESISTOR0805  [TESTPKG-R0805]  50,130 0 bottom
R597  TESTPKG-RESISTOR0805  [TESTPKG-R0805]  40,130 0 bottom
R598  TESTPKG-RESISTOR0805  [TESTPKG-R0805]  30,130 0 bottom
R599  TESTPKG-RESISTOR0805  [TESTPKG-R0805]  20,130 0 bottom
R600  TESTPKG-RESISTOR0805  [TESTPKG-R0805]  10,130 0 bottom
R601  TESTPKG-RESISTOR0805  [TESTPKG-R0805]  190,140 0 bottom
R602  TESTPKG-RESISTOR0805  [TESTPKG-R0805]  180,140 0 bottom
R603  TESTPKG-RESISTOR0805  [TESTPKG-R0805]  170,140 0 bottom
R604  TESTPKG-RESISTOR0805  [TESTPKG-R0805]  160,140 0 bottom
R605  TESTPKG-RESISTOR0805  [TESTPKG-R0805]  150,140 0 bottom
R606  TESTPKG-RESISTOR0805  [TESTPKG-R0805]  140,140 0 bottom
R607  TESTPKG-RESISTOR0805  [TESTPKG-R0805]  130,140 0 bottom
R608  TESTPKG-RESISTOR0805  [TESTPKG-R0805]  120,140 0 bottom
R609  TESTPKG-RESISTOR0805  [TESTPKG-R0805]  110,140 0 bottom
R610  TESTPKG-RESISTOR0805  [TESTPKG-R0805]  100,140 0 bottom
R611  TESTPKG-RESISTOR0805  [TESTPKG-R0805]  90,140 0 bottom
R612  TESTPKG-RESISTOR0805  [TESTPKG-R0805]  80,140 0 bottom
R613  TESTPKG-RESISTOR0805  [TESTPKG-R0805]  70,140 0 bottom
R614  TESTPKG-RESISTOR0805  [TESTPKG-R0805]  60,140 0 bottom
R615  TESTPKG-RESISTOR0805  [TESTPKG-R0805]  50,140 0 bottom
R616  TESTPKG-RESISTOR0805  [TESTPKG-R0805]  40,140 0 bottom
R617  TESTPKG-RESISTOR0805  [TESTPKG-R0805]  30,140 0 bottom
R618  TESTPKG-RESISTOR0805  [TESTPKG-R0805]  20,140 0 bottom
R619  TESTPKG-RESISTOR0805  [TESTPKG-R0805]  10,140 0 bottom
R620  TESTPKG-RESISTOR0805  [TESTPKG-R0805]  190,150 0 bottom
R621  TESTPKG-RESISTOR0805  [TESTPKG-R0805]  180,150 0 bottom
R622  TESTPKG-RESISTOR0805  [TESTPKG-R0805]  170,150 0 bottom
R623  TESTPKG-RESISTOR0805  [TESTPKG-R0805]  160,150 0 bottom
R624  TESTPKG-RESISTOR0805  [TESTPKG-R0805]  150,150 0 bottom
R625  TESTPKG-RESISTOR0805  [TESTPKG-R0805]  140,150 0 bottom
R626  TESTPKG-RESISTOR0805  [TESTPKG-R0805]  130,150 0 bottom
R627  TESTPKG-RESISTOR0805  [TESTPKG-R0805]  120,150 0 bottom
R628  TESTPKG-RESISTOR0805  [TESTPKG-R0805]  110,150 0 bottom
R629  TESTPKG-RESISTOR0805  [TESTPKG-R0805]  100,150 0 bottom
R630  TESTPKG-RESISTOR0805  [TESTPKG-R0805]  90,150 0 bottom
R631  TESTPKG-RESISTOR0805  [TESTPKG-R0805]  80,150 0 bottom
R632  TESTPKG-RESISTOR0805  [TESTPKG-R0805]  70,150 0 bottom
R633  TESTPKG-RESISTOR0805  [TESTPKG-R0805]  60,150 0 bottom
R634  TESTPKG-RESISTOR0805  [TESTPKG-R0805]  50,150 0 bottom
R635  TESTPKG-RESISTOR0805  [TESTPKG-R0805]  40,150 0 bottom
R636  TESTPKG-RESISTOR0805  [TESTPKG-R0805]  30,150 0 bottom
R637  TESTPKG-RESISTOR0805  [TESTPKG-R0805]  20,150 0 bottom
R638  TESTPKG-RESISTOR0805  [TESTPKG-R0805]  10,150 0 bottom
R639  TESTPKG-RESISTOR0805  [TESTPKG-R0805]  190,160 0 bottom
R640  TESTPKG-RESISTOR0805  [TESTPKG-R0805]  180,160 0 bottom
R641  TESTPKG-RESISTOR0805  [TESTPKG-R0805]  170,160 0 bottom
R642  TESTPKG-RESISTOR0805  [TESTPKG-R0805]  160,160 0 bottom
R643  TESTPKG-RESISTOR0805  [TESTPKG-R0805]  150,160 0 bottom
R644  TESTPKG-RESISTOR0805  [TESTPKG-R0805]  140,160 0 bottom
R645  TESTPKG-RESISTOR0805  [TESTPKG-R0805]  130,160 0 bottom
R646  TESTPKG-RESISTOR0805  [TESTPKG-R0805]  120,160 0 bottom
R647  TESTPKG-RESISTOR0805  [TESTPKG-R0805]  110,160 0 bottom
R648  TESTPKG-RESISTOR0805  [TESTPKG-R0805]  100,160 0 bottom
R649  TESTPKG-RESISTOR0805  [TESTPKG-R0805]  90,160 0 bottom
R650  TESTPKG-RESISTOR0805  [TESTPKG-R0805]  80,160 0 bottom
R651  TESTPKG-RESISTOR0805  [TESTPKG-R0805]  70,160 0 bottom
R652  TESTPKG-RESISTOR0805  [TESTPKG-R0805]  60,160 0 bottom
R653  TESTPKG-RESISTOR0805  [TESTPKG-R0805]  50,160 0 bottom
R654  TESTPKG-RESISTOR0805  [TESTPKG-R0805]  40,160 0 bottom
R655  TESTPKG-RESISTOR0805  [TESTPKG-R0805]  30,160 0 bottom
R656  TESTPKG-RESISTOR0805  [TESTPKG-R0805]  20,160 0 bottom
R657  TESTPKG-RESISTOR0805  [TESTPKG-R0805]  10,160 0 bottom
R658  TESTPKG-RESISTOR0805  [TESTPKG-R0805]  190,170 0 bottom
R659  TESTPKG-RESISTOR0805  [TESTPKG-R0805]  180,170 0 bottom
R660  TESTPKG-RESISTOR0805  [TESTPKG-R0805]  170,170 0 bottom
R661  TESTPKG-RESISTOR0805  [TESTPKG-R0805]  160,170 0 bottom
R662  TESTPKG-RESISTOR0805  [TESTPKG-R0805]  150,170 0 bottom
R663  TESTPKG-RESISTOR0805  [TESTPKG-R0805]  140,170 0 bottom
R664  TESTPKG-RESISTOR0805  [TESTPKG-R0805]  130,170 0 bottom
R665  TESTPKG-RESISTOR0805  [TESTPKG-R0805]  120,170 0 bottom
R666  TESTPKG-RESISTOR0805  [TESTPKG-R0805]  110,170 0 bottom
R667  TESTPKG-RESISTOR0805  [TESTPKG-R0805]  100,170 0 bottom
R668  TESTPKG-RESISTOR0805  [TESTPKG-R0805]  90,170 0 bottom
R669  TESTPKG-RESISTOR0805  [TESTPKG-R0805]  80,170 0 bottom
R670  TESTPKG-RESISTOR0805  [TESTPKG-R0805]  70,170 0 bottom
R671  TESTPKG-RESISTOR0805  [TESTPKG-R0805]  60,170 0 bottom
R672  TESTPKG-RESISTOR0805  [TESTPKG-R0805]  50,170 0 bottom
R673  TESTPKG-RESISTOR0805  [TESTPKG-R0805]  40,170 0 bottom
R674  TESTPKG-RESISTOR0805  [TESTPKG-R0805]  30,170 0 bottom
R675  TESTPKG-RESISTOR0805  [TESTPKG-R0805]  20,170 0 bottom
R676  TESTPKG-RESISTOR0805  [TESTPKG-R0805]  10,170 0 bottom
R677  TESTPKG-RESISTOR0805  [TESTPKG-R0805]  190,180 0 bottom
R678  TESTPKG-RESISTOR0805  [TESTPKG-R0805]  180,180 0 bottom
R679  TESTPKG-RESISTOR0805  [TESTPKG-R0805]  170,180 0 bottom
R680  TESTPKG-RESISTOR0805  [TESTPKG-R0805]  160,180 0 bottom
R681  TESTPKG-RESISTOR0805  [TESTPKG-R0805]  150,180 0 bottom
R682  TESTPKG-RESISTOR0805  [TESTPKG-R0805]  140,180 0 bottom
R683  TESTPKG-RESISTOR0805  [TESTPKG-R0805]  130,180 0 bottom
R684  TESTPKG-RESISTOR0805  [TESTPKG-R0805]  120,180 0 bottom
R685  TESTPKG-RESISTOR0805  [TESTPKG-R0805]  110,180 0 bottom
R686  TESTPKG-RESISTOR0805  [TESTPKG-R0805]  100,180 0 bottom
R687  TESTPKG-RESISTOR0805  [TESTPKG-R0805]  90,180 0 bottom
R688  TESTPKG-RESISTOR0805  [TESTPKG-R0805]  80,180 0 bottom
R689  TESTPKG-RESISTOR0805  [TESTPKG-R0805]  70,180 0 bottom
R690  TESTPKG-RESISTOR0805  [TESTPKG-R0805]  60,180 0 bottom
R691  TESTPKG-RESISTOR0805  [TESTPKG-R0805]  50,180 0 bottom
R692  TESTPKG-RESISTOR0805  [TESTPKG-R0805]  40,180 0 bottom
R693  TESTPKG-RESISTOR0805  [TESTPKG-R0805]  30,180 0 bottom
R694  TESTPKG-RESISTOR0805  [TESTPKG-R0805]  20,180 0 bottom
R695  TESTPKG-RESISTOR0805  [TESTPKG-R0805]  10,180 0 bottom
R696  TESTPKG-RESISTOR0805  [TESTPKG-R0805]  180,190 0 bottom
R697  TESTPKG-RESISTOR0805  [TESTPKG-R0805]  170,190 0 bottom
R698  TESTPKG-RESISTOR0805  [TESTPKG-R0805]  160,190 0 bottom
R699  TESTPKG-RESISTOR0805  [TESTPKG-R0805]  150,190 0 bottom
R700  TESTPKG-RESISTOR0805  [TESTPKG-R0805]  140,190 0 bottom
R701  TESTPKG-RESISTOR0805  [TESTPKG-R0805]  130,190 0 bottom
R702  TESTPKG-RESISTOR0805  [TESTPKG-R0805]  120,190 0 bottom
R703  TESTPKG-RESISTOR0805  [TESTPKG-R0805]  110,190 0 bottom
R704  TESTPKG-RESISTOR0805  [TESTPKG-R0805]  100,190 0 bottom
R705  TESTPKG-RESISTOR0805  [TESTPKG-R0805]  90,190 0 bottom
R706  TESTPKG-RESISTOR0805  [TESTPKG-R0805]  80,190 0 bottom
R707  TESTPKG-RESISTOR0805  [TESTPKG-R0805]  70,190 0 bottom
R708  TESTPKG-RESISTOR0805  [TESTPKG-R0805]  60,190 0 bottom
R709  TESTPKG-RESISTOR0805  [TESTPKG-R0805]  50,190 0 bottom
R710  TESTPKG-RESISTOR0805  [TESTPKG-R0805]  40,190 0 bottom
R711  TESTPKG-RESISTOR0805  [TESTPKG-R0805]  30,190 0 bottom
R712  TESTPKG-RESISTOR0805  [TESTPKG-R0805]  20,190 0 bottom
TP1  CONN-TESTPOINT  [CON-TESTPOINT]  15,10 0 top
TP2  CONN-TESTPOINT  [CON-TESTPOINT]  9,15 0 top
TP3  CONN-TESTPOINT  [CON-TESTPOINT]  9,25 0 top
TP4  CONN-TESTPOINT  [CON-TESTPOINT]  9,35 0 top
TP5  CONN-TESTPOINT  [CON-TESTPOINT]  9,45 0 top
TP6  CONN-TESTPOINT  [CON-TESTPOINT]  9,55 180 top
TP7  CONN-TESTPOINT  [CON-TESTPOINT]  9,65 180 top
TP8  CONN-TESTPOINT  [CON-TESTPOINT]  9,75 180 top
TP9  CONN-TESTPOINT  [CON-TESTPOINT]  9,85 180 top
TP10  CONN-TESTPOINT  [CON-TESTPOINT]  9,95 180 top
TP11  CONN-TESTPOINT  [CON-TESTPOINT]  9,105 180 top
TP12  CONN-TESTPOINT  [CON-TESTPOINT]  9,115 180 top
TP13  CONN-TESTPOINT  [CON-TESTPOINT]  9,125 180 top
TP14  CONN-TESTPOINT  [CON-TESTPOINT]  9,135 180 top
TP15  CONN-TESTPOINT  [CON-TESTPOINT]  9,145 180 top
TP16  CONN-TESTPOINT  [CON-TESTPOINT]  9,155 180 top
TP17  CONN-TESTPOINT  [CON-TESTPOINT]  9,165 180 top
TP18  CONN-TESTPOINT  [CON-TESTPOINT]  9,175 180 top
TP19  CONN-TESTPOINT  [CON-TESTPOINT]  10,185 180 top
TP20  CONN-TESTPOINT  [CON-TESTPOINT]  185,190 0 top
TP21  CONN-TESTPOINT  [CON-TESTPOINT]  185,10 0 bottom
TP22  CONN-TESTPOINT  [CON-TESTPOINT]  190,15 0 bottom
TP23  CONN-TESTPOINT  [CON-TESTPOINT]  190,25 0 bottom
TP24  CONN-TESTPOINT  [CON-TESTPOINT]  190,35 0 bottom
TP25  CONN-TESTPOINT  [CON-TESTPOINT]  190,45 0 bottom
TP26  CONN-TESTPOINT  [CON-TESTPOINT]  190,55 0 bottom
TP27  CONN-TESTPOINT  [CON-TESTPOINT]  190,65 0 bottom
TP28  CONN-TESTPOINT  [CON-TESTPOINT]  190,75 0 bottom
TP29  CONN-TESTPOINT  [CON-TESTPOINT]  190,85 0 bottom
TP30  CONN-TESTPOINT  [CON-TESTPOINT]  190,95 0 bottom
TP31  CONN-TESTPOINT  [CON-TESTPOINT]  190,105 0 bottom
TP32  CONN-TESTPOINT  [CON-TESTPOINT]  190,115 0 bottom
TP33  CONN-TESTPOINT  [CON-TESTPOINT]  190,125 0 bottom
TP34  CONN-TESTPOINT  [CON-TESTPOINT]  190,135 0 bottom
TP35  CONN-TESTPOINT  [CON-TESTPOINT]  190,145 0 bottom
TP36  CONN-TESTPOINT  [CON-TESTPOINT]  190,155 0 bottom
TP37  CONN-TESTPOINT  [CON-TESTPOINT]  190,165 0 bottom
TP38  CONN-TESTPOINT  [CON-TESTPOINT]  190,175 0 bottom
TP39  CONN-TESTPOINT  [CON-TESTPOINT]  190,185 0 bottom
TP40  CONN-TESTPOINT  [CON-TESTPOINT]  15,190 0 bottom